# EAGLE design SparkFun_Qwiic_CO2_Sensor_XENSIV_PAS (EAGLE 9.6.2)
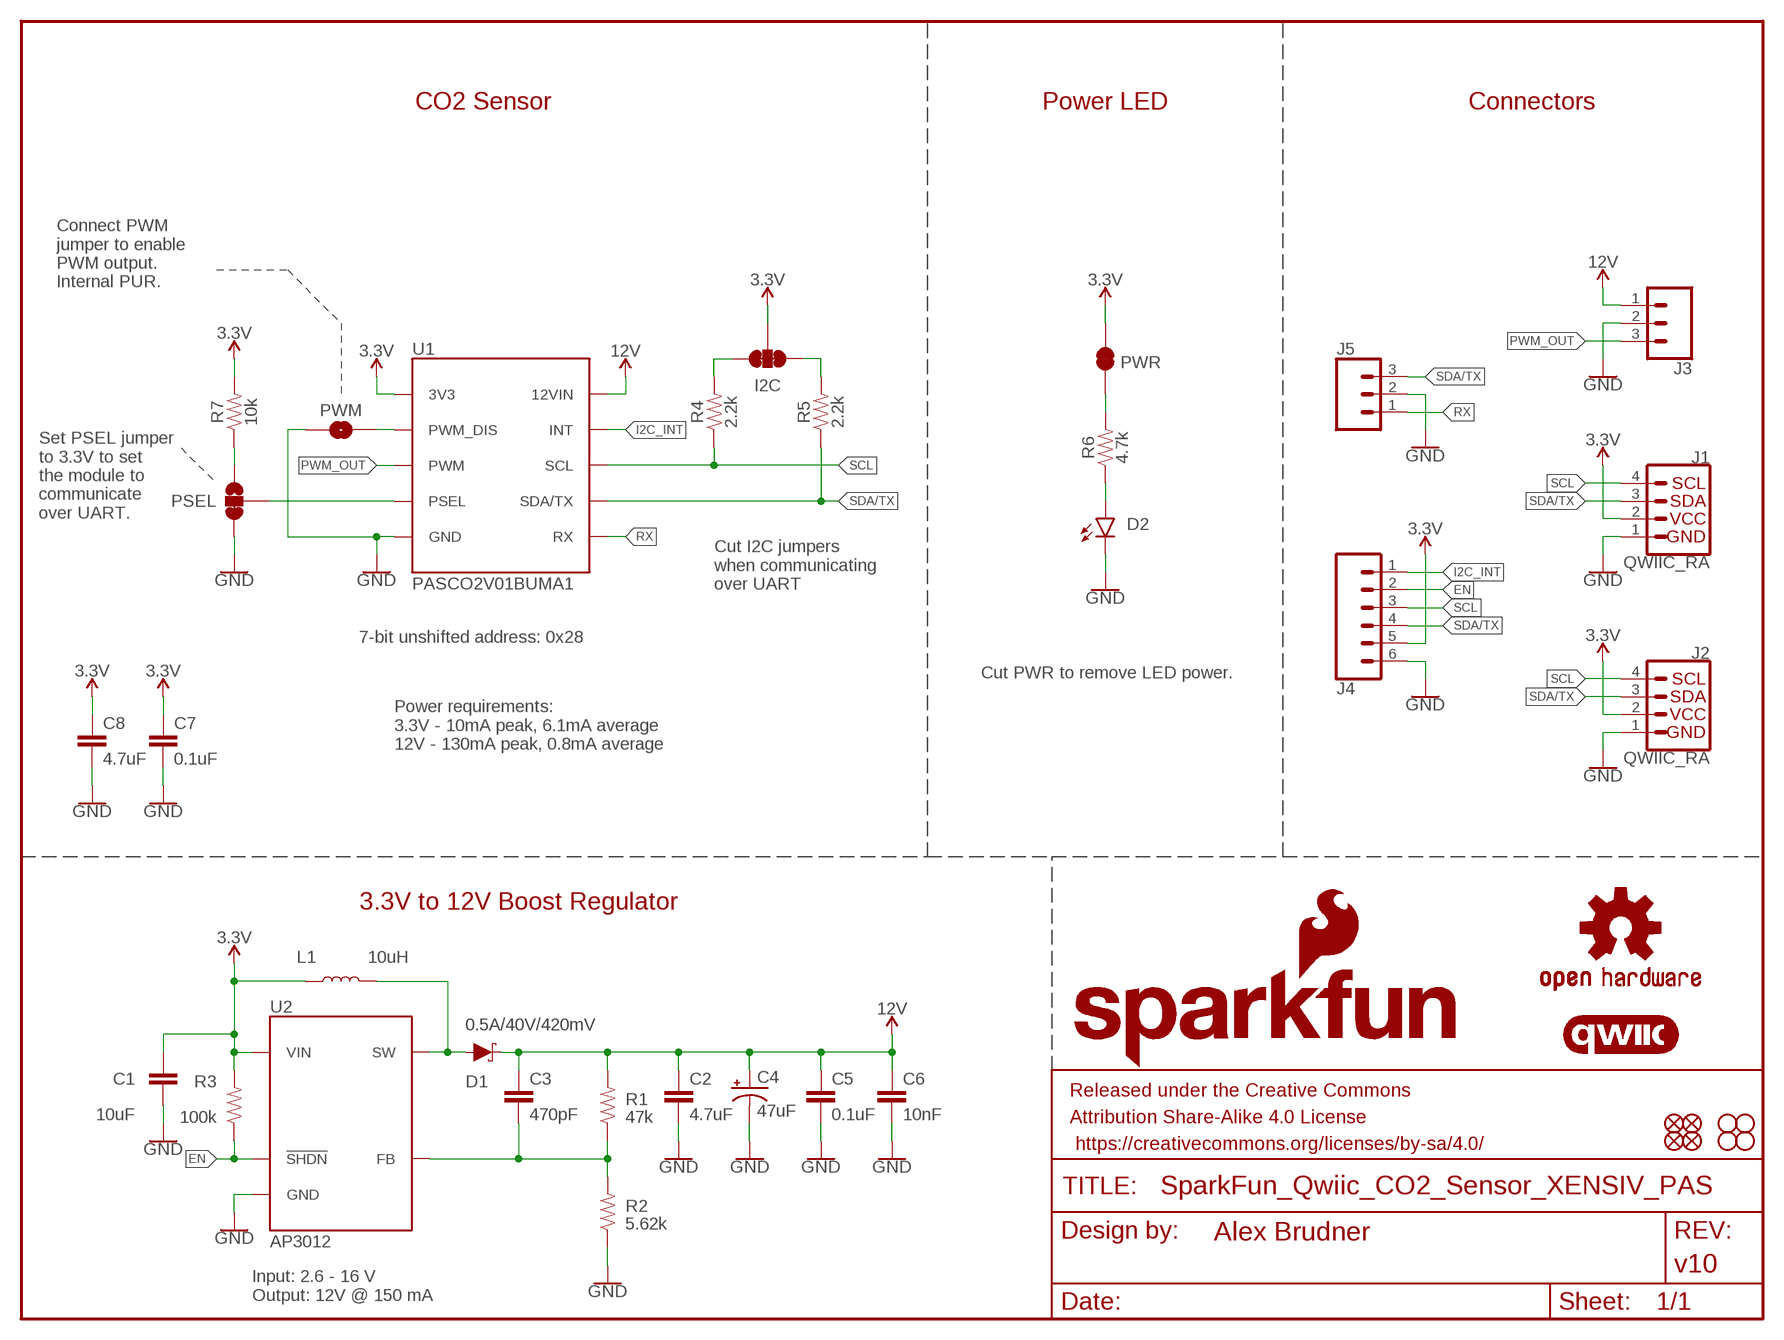
[diagram p0: schematic, sheet 1]

## Parts
C1  10uF  10UF-0805-25V-10%  [0805]
C2  4.7uF  4.7UF-0603-35V-(20%)  [0603]
C3  470pF  470PF-0603-50V-5%  [0603]
C4  47uF  47UF-POLAR-PANASONIC_D-35V-20%  [PANASONIC_D]
C5  0.1uF  0.1UF-0603-25V-5%  [0603]
C6  10nF  10NF-0603-50V-10%  [0603]
C7  0.1uF  0.1UF-0603-25V-5%  [0603]
C8  4.7uF  4.7UF-0603-35V-(20%)  [0603]
D1  0.5A/40V/420mV  DIODE-SCHOTTKY-PMEG4005EJ  [SOD-323]
D2  LED-RED_0603-KB  [LED-0603]
FD1  FIDUCIALUFIDUCIAL  [FIDUCIAL-MICRO]
FD2  FIDUCIALUFIDUCIAL  [FIDUCIAL-MICRO]
FD3  FIDUCIALUFIDUCIAL  [FIDUCIAL-MICRO]
FD4  FIDUCIALUFIDUCIAL  [FIDUCIAL-MICRO]
FRAME1  FRAME-LETTER  [CREATIVE_COMMONS]
H1  STAND-OFF  [STAND-OFF]
H2  STAND-OFF  [STAND-OFF]
H3  STAND-OFF  [STAND-OFF]
H4  STAND-OFF  [STAND-OFF]
I2C  JUMPER-SMT_3_2-NC_TRACE_SILK  [SMT-JUMPER_3_2-NC_TRACE_SILK]
J1  QWIIC_RA  QWIIC_CONNECTORJS-1MM  [JST04_1MM_RA]
J2  QWIIC_RA  QWIIC_CONNECTORJS-1MM  [JST04_1MM_RA]
J3  CONN_031X03_NO_SILK  [1X03_NO_SILK]
J4  CONN_06NO_SILK_NO_POP  [1X06_NO_SILK]
J5  CONN_031X03_NO_SILK  [1X03_NO_SILK]
L1  10uH  10UH  [0805]
LOGO1  SFE_LOGO_NAME_FLAME.1_INCH  [SFE_LOGO_NAME_FLAME_.1]
LOGO2  QWIIC_LOGO_5MM  [QWIIC_5MM]
LOGO3  OSHW-LOGOMINI  [OSHW-LOGO-MINI]
PSEL  JUMPER-SMT_3_1-NC_TRACE_SILK  [SMT-JUMPER_3_1-NC_TRACE_SILK]
PWM  JUMPER-SMT_2_NO_SILK  [SMT-JUMPER_2_NO_SILK]
PWR  JUMPER-SMT_2_NC_TRACE_SILK  [SMT-JUMPER_2_NC_TRACE_SILK]
R1  47k  47KOHM-0603-1/10W-1%  [0603]
R2  5.62k  5.62KOHM-0603-1/10W-1%  [0603]
R3  100k  100KOHM-0603-1/10W-1%  [0603]
R4  2.2k  2.2KOHM-0603-1/10W-1%  [0603]
R5  2.2k  2.2KOHM-0603-1/10W-1%  [0603]
R6  4.7k  4.7KOHM-0603-1/10W-1%  [0603]
R7  10k  10KOHM-0603-1/10W-1%  [0603]
U1  PASCO2V01BUMA1  PASCO2V01  [LG-MLGA-14-1_Z8B00206105]
U2  AP3012  [SOT95P280X145-5M]

## Nets
3.3V: C1.1 C7.1 C8.1 I2C.2 J1.2 J2.2 J4.5 L1.1 PWR.2 R3.2 R7.2 U1.1(3V3) U2.5(VIN)
12V: C2.1 C3.1 C4.+ C5.1 C6.1 D1.C J3.1 R1.2 U1.10(12VIN)
EN: J4.2 R3.1 U2.4(!SHDN!)
GND: C1.2 C2.2 C4.- C5.2 C6.2 C7.2 C8.2 D2.C J1.1 J2.1 J3.2 J4.6 J5.2 PSEL.3 PWM.1 R2.1 U1.6(GND) U1.11(GND) U1.12(GND) U1.13(GND) U1.14(GND) U2.2(GND)
I2C_INT: J4.1 U1.7(INT)
N$1: I2C.1 R5.2
N$2: D1.A L1.2 U2.1(SW)
N$3: I2C.3 R4.2
N$4: C3.2 R1.1 R2.2 U2.3(FB)
N$5: PSEL.2 U1.8(PSEL)
N$6: D2.A R6.1
N$7: PWR.1 R6.2
N$8: PSEL.1 R7.1
N$9: PWM.2 U1.5(PWM_DIS)
PWM_OUT: J3.3 U1.9(PWM)
RX: J5.1 U1.2(RX)
SCL: J1.4 J2.4 J4.3 R4.1 U1.3(SCL)
SDA/TX: J1.3 J2.3 J4.4 J5.3 R5.1 U1.4(SDA/TX)

## Notes on the sheet
- CO2 Sensor | Power LED | Connectors
- Connect PWM 
  jumper to enable 
  PWM output.
  Internal PUR.
- Set PSEL jumper 
  to 3.3V to set 
  the module to 
  communicate 
  over UART.
- Cut I2C jumpers 
  when communicating
  over UART
- 7-bit unshifted address: 0x28
- Cut PWR to remove LED power.
- Power requirements:
  3.3V - 10mA peak, 6.1mA average
  12V - 130mA peak, 0.8mA average
- 3.3V to 12V Boost Regulator
- Input: 2.6 - 16 V
  Output: 12V @ 150 mA

## Library data of the parts
C1 = SparkFun-Capacitors:10UF: 10.0µF ceramic capacitors A capacitor is a passive two-terminal electrical component used to store electrical energy temporarily in an electric field.; PROD_ID: CAP-14259
C2 C8 = SparkFun-Capacitors:4.7UF: 4.7µF ceramic capacitors A capacitor is a passive two-terminal electrical component used to store electrical energy temporarily in an electric field.; PROD_ID: CAP-14106
C3 = SparkFun-Capacitors:470PF: 470pF ceramic capacitors A capacitor is a passive two-terminal electrical component used to store electrical energy temporarily in an electric field.; PROD_ID: CAP-07884
C4 = SparkFun-Capacitors:47UF-POLAR: 47µF polarized capacitors A capacitor is a passive two-terminal electrical component used to store electrical energy temporarily in an electric field.; PROD_ID: CAP-08478
C5 C7 = SparkFun-Capacitors:0.1UF: 0.1µF ceramic capacitors A capacitor is a passive two-terminal electrical component used to store electrical energy temporarily in an electric field.; PROD_ID: CAP-08604
C6 = SparkFun-Capacitors:10NF: 0.01uF/10nF/10,000pF ceramic capacitors A capacitor is a passive two-terminal electrical component used to store electrical energy temporarily in an electric field. CAP-09321; PROD_ID: CAP-00867
D1 = SparkFun-DiscreteSemi:DIODE-SCHOTTKY: Schottky diode A Schottky diode is a semiconductor diode which has a low forward voltage drop and a very fast switching action.; PROD_ID: DIO-10955
D2 = SparkFun-LED:LED-RED: Red SMD LED Used in manufacturing of most products at SparkFun Packages: 0603 - KB - KingBright (DIO-17976) SMD 0603 package [Datasheet] <https://www.kingbrightusa.com/images/catalog/SPEC/APT1608SURCK.pdf> 0603 - (DIO-00819, has gone EOL) SMD 0603 package 0603 SMART - SMD 0603 SMART package ( more efficient and expensive)[Product Link] <http://www.osram-os.com/Graphics/XPic2/00077099_0.pdf> 1206 - SMD1206 package [Product Link] <https://www.sparkfun.com/datasheets/DevTools/LilyPad/Q150OVS4.pdff> SparkFun Products: Pro Mini 328 -5V <https://www.sparkfun.com/products/821> RedBoard <https://www.sparkfun.com/products/12757> IOIO-OTG <https://www.sparkfun.com/products/13613>; PROD_ID: DIO-17976
FD1-FD4 = SparkFun-Aesthetics:FIDUCIAL: Fiducial Alignment Points Point-of-reference for pick-and-place machines and other optical instruments.
FRAME1 = SparkFun-Aesthetics:FRAME-LETTER: Schematic Frame - Letter Standard 8.5x11 US Letter frame; DESIGNER: Alex Brudner; REV: v10
H1-H4 = SparkFun-Hardware:STAND-OFF: Stand Off Drill holes for mechanically mounting via screws, standoffs, etc. Note: Use the keepout ring to avoid running the screw head into surrounding components. Variant Overviews STAND-OFF - Mechanical footprint for a #4 phillips button head screw. STAND-OFF-TIGHT - Mechanical footprint for a #4 phillips button head screw, Example SparkFun Products Screw - Phillips Head (1/4", 4-40, 10 pack) <https://www.sparkfun.com/products/10453> (PRT-10453) Screw - Phillips Head (1/2", 4-40, 10 pack) <https://www.sparkfun.com/products/10452> (PRT-10452) Screw - Phillips Head (3/4", 4-40, 10 pack) <https://www.sparkfun.com/products/10451> (PRT-10451) Screw - Phillips Head (1", 4-40, 10 pack) <https://www.sparkfun.com/products/10450> (PRT-10450)
I2C = SparkFun-Jumpers:JUMPER-SMT_3_2-NC_TRACE: Normally closed trace jumper (2 of 2 connections) This jumper has a trace between all three pads so they are normally closed (NC). Use a razor knife to open the connection(s). For best results follow the IPC guidelines for cutting traces: Cutout at least 0.063 mm (0.005 in). Remove all loose material to clean up the cut area. Seal the cut with an approved epoxy. Reapply solder to reclose the connection(s).
J1 J2 = SparkFun-Connectors:QWIIC_CONNECTOR: SparkFun I2C Standard Qwiic Connector An SMD 1mm pitch JST connector makes it easy and quick (get it? Qwiic?) to connect I2C devices to each other. The Qwiic system <http://www.sparkfun.com/qwiic> enables fast and solderless connection between popular platforms and various sensors and actuators. We carry 200mm <https://www.sparkfun.com/products/14204>, 100mm <https://www.sparkfun.com/products/14205>, 50mm <https://www.sparkfun.com/products/14206>, and breadboard friendly <https://www.sparkfun.com/products/14207> Qwiic cables. We also offer 10 pcs strips <https://www.sparkfun.com/products/14323> the SMD connectors.; PROD_ID: CONN-13694; VALUE: QWIIC_RIGHT_ANGLE
J3 J5 = SparkFun-Connectors:CONN_03: Multi connection point. Often used as Generic Header-pin footprint for 0.1 inch spaced/style header connections On any of the 0.1 inch spaced packages, you can populate with these: Break Away Headers - Straight <https://www.sparkfun.com/products/116> (PRT-00116) Break Away Male Headers - Right Angle <https://www.sparkfun.com/products/553> (PRT-00553) Female Headers <https://www.sparkfun.com/products/115> (PRT-00115) Break Away Headers - Machine Pin <https://www.sparkfun.com/products/117> (PRT-00117) Break Away Female Headers - Swiss Machine Pin <https://www.sparkfun.com/products/743> (PRT-00743) Stackable Header - 3 Pin (Female, 0.1") <https://www.sparkfun.com/products/13875> (PRT-13875) For SCREWTERMINALS and SPRING TERMINALS visit here: Screw Terimnals on SparkFun.com <https://www.sparkfun.com/search/results?term=Screw+Terminals> (5mm/3.5mm/2.54mm spacing) This device is also useful as a general connection point to wire up your design to another part of your project. Our various solder wires solder well into these plated through hole pads. Hook-Up Wire - Assortment (Stranded, 22 AWG) <https://www.sparkfun.com/products/11375> (PRT-11375) Hook-Up Wire - Assortment (Solid Core, 22 AWG) <https://www.sparkfun.com/products/11367> (PRT-11367) View the entire wire category on our website here <https://www.sparkfun.com/categories/141> Special notes: Molex polarized connector foot print use with SKU : PRT-08232 with associated crimp pins and housings.
J4 = SparkFun-Connectors:CONN_06: Multi connection point. Often used as Generic Header-pin footprint for 0.1 inch spaced/style header connections On any of the 0.1 inch spaced packages, you can populate with these: Break Away Headers - Straight <https://www.sparkfun.com/products/116> (PRT-00116) Break Away Male Headers - Right Angle <https://www.sparkfun.com/products/553> (PRT-00553) Female Headers <https://www.sparkfun.com/products/115> (PRT-00115) Break Away Headers - Machine Pin <https://www.sparkfun.com/products/117> (PRT-00117) Break Away Female Headers - Swiss Machine Pin <https://www.sparkfun.com/products/743> (PRT-00743) Arduino Stackable Header - 6 Pin <https://www.sparkfun.com/products/9280> (PRT-09280) Screw Terminals 2.54mm Pitch (6-Pin) <https://www.sparkfun.com/products/16499> (PRT-16499) For SCREWTERMINALS and SPRING TERMINALS visit here: Screw Terimnals on SparkFun.com <https://www.sparkfun.com/search/results?term=Screw+Terminals> (5mm/3.5mm/2.54mm spacing) This device is also useful as a general connection point to wire up your design to another part of your project. Our various solder wires solder well into these plated through hole pads. Hook-Up Wire - Assortment (Stranded, 22 AWG) <https://www.sparkfun.com/products/11375> (PRT-11375) Hook-Up Wire - Assortment (Solid Core, 22 AWG) <https://www.sparkfun.com/products/11367> (PRT-11367) View the entire wire category on our website here <https://www.sparkfun.com/categories/141>
L1 = xensiv_pas:10UH; PN: MLZ2012M100WT000; PROD_ID: NDUC-19198
LOGO1 = SparkFun-Aesthetics:SFE_LOGO_NAME_FLAME: SparkFun Font Logo w/ Flame This is the SparkFun full logo. The logo on the schematic will always be the same size; the package variant is the height of the flame part of the logo. Default layer for the logo on the board is tSilk.
LOGO2 = SparkFun-Aesthetics:QWIIC_LOGO: Qwiic Logos for placement on schematic and PCB. The 5.5mm silk logo is best for placing next to Qwiic connector.
LOGO3 = SparkFun-Aesthetics:OSHW-LOGO: Open-Source Hardware (OSHW) Logo This logo indicates the piece of hardware it is found on incorporates a OSHW license and/or adheres to the definition of open source hardware found here: http://freedomdefined.org/OSHW
PSEL = SparkFun-Jumpers:JUMPER-SMT_3_1-NC_TRACE: Normally closed trace jumper (1 of 2 connections) This jumper has a trace between two pads so it's normally closed (NC). The other connection is normally open (NO). Use a razor knife to open the connection. For best results follow the IPC guidelines for cutting traces: Cutout at least 0.063 mm (0.005 in). Remove all loose material to clean up the cut area. Seal the cut with an approved epoxy. Reapply solder to reclose the connection, or to close the NO connection.
PWM = SparkFun-Jumpers:JUMPER-SMT_2_NO: Normally open jumper This jumper has two pads in close proximity to each other. Apply solder to close the connection. Round pads are easier to solder for beginners, but are a lot larger. SparkFun Product that uses the round pads: SparkFun EL Sequencer <https://www.sparkfun.com/products/12781>
PWR = SparkFun-Jumpers:JUMPER-SMT_2_NC_TRACE: Normally closed trace jumper This jumper has a trace between two pads so it's normally closed (NC). Use a razor knife to open the connection. For best results follow the IPC guidelines for cutting traces: Cutout at least 0.063 mm (0.005 in). Remove all loose material to clean up the cut area. Seal the cut with an approved epoxy. Reapply solder to reclose the connection.
R1 = SparkFun-Resistors:47KOHM: 47kΩ resistor A resistor is a passive two-terminal electrical component that implements electrical resistance as a circuit element. Resistors act to reduce current flow, and, at the same time, act to lower voltage levels within circuits. - Wikipedia; PROD_ID: RES-07871
R2 = SparkFun-Resistors:5.62KOHM: 5.62kΩ resistor A resistor is a passive two-terminal electrical component that implements electrical resistance as a circuit element. Resistors act to reduce current flow, and, at the same time, act to lower voltage levels within circuits. - Wikipedia; PROD_ID: RES-09823
R3 = SparkFun-Resistors:100KOHM: 100kΩ resistor A resistor is a passive two-terminal electrical component that implements electrical resistance as a circuit element. Resistors act to reduce current flow, and, at the same time, act to lower voltage levels within circuits. - Wikipedia; PROD_ID: RES-07828
R4 R5 = SparkFun-Resistors:2.2KOHM: 2.2kΩ resistor A resistor is a passive two-terminal electrical component that implements electrical resistance as a circuit element. Resistors act to reduce current flow, and, at the same time, act to lower voltage levels within circuits. - Wikipedia; PROD_ID: RES-08272
R6 = SparkFun-Resistors:4.7KOHM: 4.7kΩ resistor A resistor is a passive two-terminal electrical component that implements electrical resistance as a circuit element. Resistors act to reduce current flow, and, at the same time, act to lower voltage levels within circuits. - Wikipedia; PROD_ID: RES-07857
R7 = SparkFun-Resistors:10KOHM: 10kΩ resistor A resistor is a passive two-terminal electrical component that implements electrical resistance as a circuit element. Resistors act to reduce current flow, and, at the same time, act to lower voltage levels within circuits. - Wikipedia; PROD_ID: RES-00824
U1 = xensiv_pas:PASCO2V01; PROD_ID: IC-19132
U2 = xensiv_pas:AP3012; PN: AP3012; PROD_ID: VREG-13911

## Board
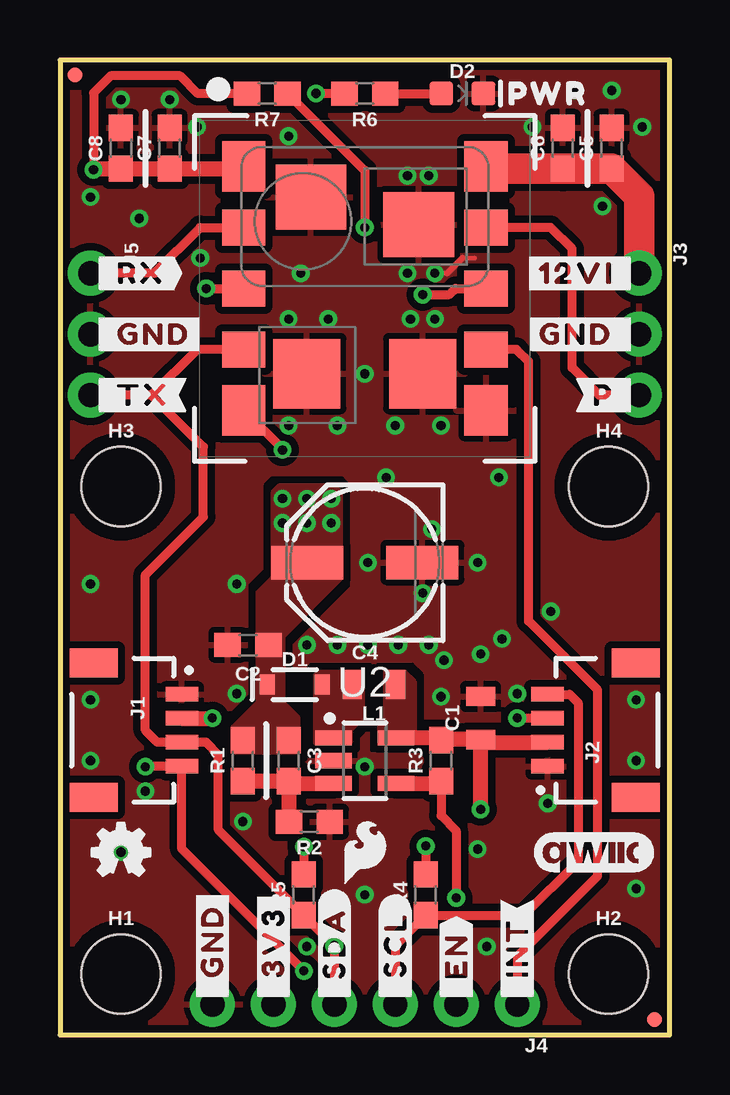
[diagram p1: board, top side]
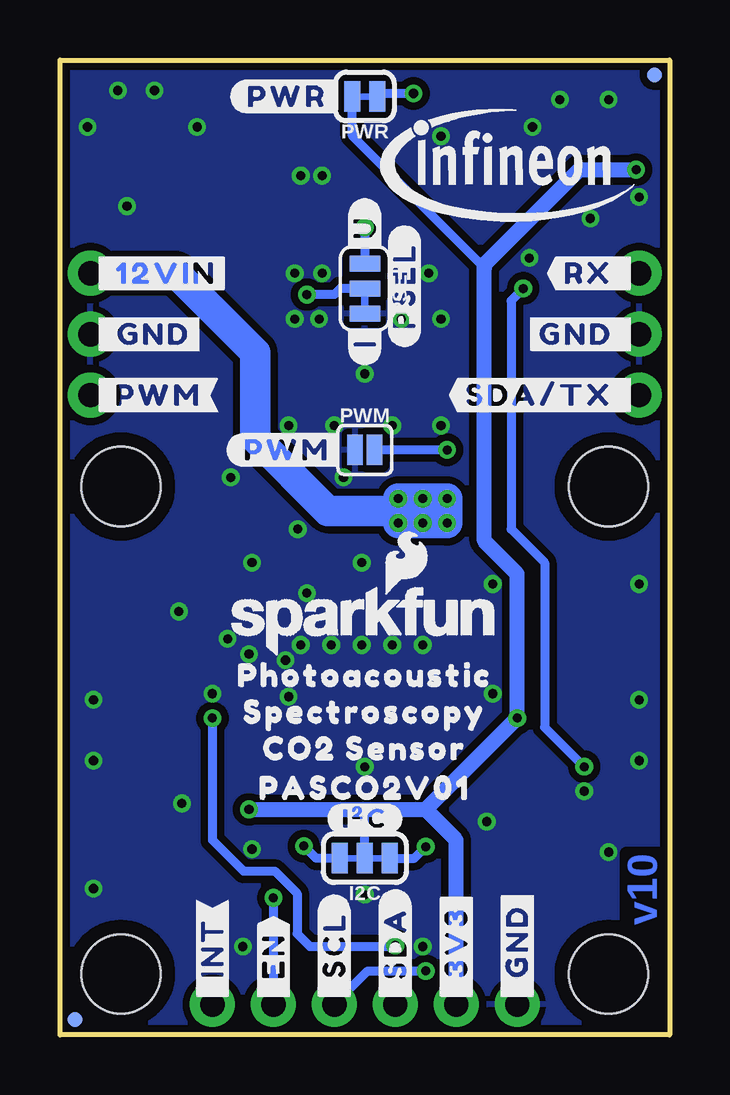
[diagram p2: board, bottom side, seen from below]

Size 25.4 x 40.64 mm. Coordinates in mm from the lower left corner, seen from the top.
Outline: 0,0 25.4,0 25.4,40.64 0,40.64 0,0
Copper layers (1*16): Top 0.035mm / dielectric 1.5mm / Bottom 0.035mm
Design rules "SparkFun-2-Layer-General-JLCPCB": minimum track width 7mil, minimum drill 0.3mm, track to track 7mil, track to pad 7mil, pad to pad 7mil, via to via 7mil, smd to smd 7mil, copper to edge 7mil, drill to drill 7mil, minimum pad ring 7mil, minimum via ring 7mil, stop-mask expansion 3mil, vias tented up to drill 25mil, thermal gap 10mil
tRestrict: area 9.8,14.9 to 10.2,15

### Footprints (pad centres in the part's own frame; a part is rotated, then mirrored left to right if it is on the bottom)
0805 = smd 0.8 x 1.2: 1 -0.9,0; 2 0.9,0
0603 = smd 1.1 x 1: 1 -0.85,0; 2 0.85,0
PANASONIC_D = smd 3 x 1.4: + 2.4,0; - -2.4,0
SOD-323 = smd 0.63 x 0.83: A 1.15,0; C -1.15,0
LED-0603 = smd 1 x 1: A -0.877,0; C 0.877,0
FIDUCIAL-MICRO = smd 0.635 x 0.635: 1 0,0
STAND-OFF = hole 3.302: 0,0
SMT-JUMPER_3_2-NC_TRACE_SILK = smd 0.66 x 1.27: 1 -1.041,0; 2 0,0; 3 1.041,0
JST04_1MM_RA = smd 0.6 x 1.35: 1 -1.5,0; 2 -0.5,0; 3 0.5,0; 4 1.5,0 | smd 1.2 x 2: NC1 2.8,-3.675; NC2 -2.8,-3.675
1X03_NO_SILK = drill 1.016 pad 1.88: 1 0,0; 2 2.54,0; 3 5.08,0
1X06_NO_SILK = drill 1.016 pad 1.88: 1 0,0; 2 2.54,0; 3 5.08,0; 4 7.62,0; 5 10.16,0; 6 12.7,0
SMT-JUMPER_3_1-NC_TRACE_SILK = smd 0.66 x 1.27: 1 -1.041,0; 2 0,0; 3 1.041,0
SMT-JUMPER_2_NO_SILK = smd 0.635 x 1.27: 1 -0.406,0; 2 0.406,0
SMT-JUMPER_2_NC_TRACE_SILK = smd 0.66 x 1.27: 1 -0.521,0; 2 0.521,0
LG-MLGA-14-1_Z8B00206105 = smd 2.1 x 1.8: 1 -5.08,-5.05; 5 5.08,-5.05; 6 5.08,5.05; 10 -5.08,5.05 | smd 1.5 x 1.8: 2 -2.54,-5.05; 3 0,-5.05; 4 2.54,-5.05; 7 2.54,5.05; 8 0,5.05; 9 -2.54,5.05 | smd 2.7 x 2.95: 11 -2.655,2.245; 12 -3.805,-2.245 | smd 2.9 x 2.8: 13 3.55,-2.415; 14 3.55,2.415
SOT95P280X145-5M = smd 1.509 x 0.629: 1 -1.303,0.95; 2 -1.303,0; 3 -1.303,-0.95; 4 1.303,-0.95; 5 1.303,0.95

### Placement (x,y rotation side)
C1  17.53,13.21 90 top
C2  7.83,16.26 180 top
C3  9.53,11.43 270 top
C4  12.7,19.68 180 top
C5  22.99,36.96 90 top
C6  20.95,36.96 90 top
C7  4.57,36.96 90 top
C8  2.54,36.96 90 top
D1  9.78,14.61 0 top
D2  16.76,39.24 0 top
FD1  24.77,0.64 0 bottom
FD2  0.64,40.01 0 bottom
FD3  0.64,40.01 0 top
FD4  24.77,0.64 0 top
FRAME1  51.94,-9.4 0 top  (outside the outline)
H1  2.54,2.54 0 top
H2  22.86,2.54 0 top
H3  2.54,22.86 0 top
H4  22.86,22.86 0 top
I2C  12.7,7.37 180 bottom
J1  5.08,12.7 270 top
J2  20.32,12.7 90 top
J3  24.13,31.75 270 top
J4  19.05,1.27 180 top
J5  1.27,31.75 270 top
L1  13.08,14.61 180 top
LOGO1  12.7,17.27 0 bottom
LOGO2  22.23,7.62 0 top
LOGO3  2.54,7.62 0 top
PSEL  12.7,31.11 270 bottom
PWM  12.7,24.38 0 bottom
PWR  12.7,39.12 180 bottom
R1  7.62,11.43 90 top
R2  10.39,8.89 180 top
R3  15.88,11.43 90 top
R4  15.24,5.84 90 top
R5  10.16,5.84 90 top
R6  12.7,39.24 180 top
R7  8.64,39.24 180 top
U1  12.7,31.11 270 top
U2  12.7,11.43 0 top
U$1  [SFE_LOGO_FLAME_.1]  12.7,7.62 0 top
U$2  [#_12VIN#0]  24.13,31.75 0 bottom
U$3  [#_EN#0]  16.51,1.27 90 top
U$4  [#GND_#0]  24.13,29.21 0 top
U$5  [#GND_#0]  1.27,29.21 0 bottom
U$6  [#_TX#0]  1.27,26.67 0 top
U$7  [#_RX#0]  1.27,31.75 0 top
U$8  [#_GND#0]  1.27,29.21 0 top
U$9  [#_GND#0]  24.13,29.21 0 bottom
U$10  [#_EN#0]  16.51,1.27 90 bottom
U$11  [#_3V3#0]  8.89,1.27 90 bottom
U$12  [#RX_#0]  1.27,31.75 0 bottom
U$13  [#SDA#TX_#0]  1.27,26.67 0 bottom
U$14  [#_GND#0]  6.35,1.27 90 top
U$15  [#_SCL#0]  13.97,1.27 90 top
U$16  [#PWM#0]  13.46,24.38 0 bottom
U$17  [#P_#0]  24.13,26.67 0 top
U$18  [#_GND#0]  6.35,1.27 90 bottom
U$19  [#_3V3#0]  8.89,1.27 90 top
U$20  [#_SDA#0]  11.43,1.27 90 top
U$21  [#_INT#0]  19.05,1.27 90 top
U$22  [#_INT#0]  19.05,1.27 90 bottom
U$23  [INFINEON_LOGO]  7.58,37.36 0 bottom
U$24  [#PSEL#0]  11.05,28.7 90 bottom
U$25  [CO2_SENSOR0]  12.7,11.94 0 bottom
U$26  [SFE_LOGO_FLAME_STOP_.1]  22.86,36.83 0 bottom
U$27  [#I�C#0]  12.7,9.02 0 bottom
U$28  [#PWR#0]  13.59,39.12 0 bottom
U$29  [PWR0]  20.32,39.24 0 top
U$30  [ORDERING_INSTRUCTIONS]  31.24,50.8 0 top  (outside the outline)
U$31  [#I#0]  12.7,28.83 90 bottom
U$32  [#U#0]  12.7,33.66 90 bottom
U$33  [#12VI_#0]  24.13,31.75 0 top
U$34  [#_PWM#0]  24.13,26.67 0 bottom
U$35  [#_SDA#0]  11.43,1.27 90 bottom
U$36  [#_SCL#0]  13.97,1.27 90 bottom
U$37  [PHOTOACOUSTIC0]  12.7,14.99 0 bottom
U$38  [SPECTROSCOPY0]  12.7,13.46 0 bottom
U$39  [PASCO2V010]  12.7,10.29 0 bottom

### Tracks (layer width: path | path; a pad name or v marks a point on that pad's centre or on a via)
3.3V  (via drill 0.38)
  Top 0.381: R7.2 5.74,39.24 5,39.98 2.11,39.98 1.4,39.27 v1.4,36.07
  Top 0.635: 7.56,36.11 C7.1 C8.1 1.44,36.11 v1.4,36.07 | C1.1 17.63,12.2 J2.2 | v17.53,9.4 C1.1 | J1.2 v6.34,13.2 v6.35,13.21 | C1.1 15.9,12.31 R3.2 15.78,12.38 U2.5
  Top 0.762: 7.56,36.11 U1.1
  Bottom 0.381: PWR.2 13.22,37.48 7.72,31.98 | I2C.2 12.7,9.4
  Bottom 0.635: 10.16,9.4 v6.35,13.21 6.35,19.22 7.72,20.59 7.72,31.98 7.72,32.11 3.76,36.07 v1.4,36.07 | v17.53,9.4 12.7,9.4 10.16,9.4 | J4.5 8.89,8.13 10.16,9.4
  pour Top (isolate 0.305, no thermals): 13.34,12.19 13.34,12.83 13.59,13.08 13.59,15.11 14.35,15.11 14.73,14.73 14.73,12.19
12V  (via drill 0.38)
  Top 1.27: U1.10 17.84,36.11 C6.1 C5.1 24.13,34.96 J3.1
  Bottom 1.27: v10.29,21.34 v9.27,21.34 v9.27,22.35 v10.29,22.35 v11.3,22.35 v11.3,21.34 v10.29,21.34 | v10.29,21.34 10.79,21.84 14.24,21.84 17.27,24.87 17.27,28.45 20.57,31.75 J3.1
  pour Top (isolate 0.305, no thermals): 9.91,11.81 9.91,13.21 9.27,13.84 9.27,16.64 11.68,19.05 11.68,22.61 11.43,22.86 9.14,22.86 8.89,22.61 8.89,19.05 8.26,18.41 8.26,13.84 7.24,12.83 7.24,11.81
EN  (via drill 0.38)
  Top 0.381: R3.1 15.88,9.14 16.51,8.51 v16.51,5.71
  Top 0.635: U2.4 15.78,10.48 R3.1
  Bottom 0.381: v16.51,5.71 J4.2
GND  (via drill 0.38)
  Top 0.178: v15.62,31.75 16.13,31.75 | 16.76,32.38 17.27,32.38
  Top 0.254: 16.13,31.75 16.76,32.38
  other vias: 15.88,25.4 13.97,25.4 11.56,25.4 9.53,25.4 9.53,29.84 11.18,29.84 14.61,29.84 15.62,29.84 14.48,31.75 10.03,31.75 9.53,37.47 14.48,35.81 15.37,35.81 7.37,18.8 12.7,11.18 15.88,14.1 24,11.43 24,13.97 2.54,7.62 1.27,11.43 1.27,13.97 1.27,18.8 12.83,19.68 17.4,19.68 12.7,27.56 3.3,34.04 1.27,34.92 5.71,37.85 2.54,38.99 4.57,38.99 21.46,39.37 22.99,39.37 24.26,37.85 19.68,37.85 22.61,34.54 18.29,23.24 10.29,16.26 13.59,23.24 15.49,21.08 15.11,18.41 17.53,15.88 11.56,16.26 12.83,16.26 14.1,16.26 15.37,16.26 16,15.62 7.37,14.22 20.45,17.65 18.41,16.51 24,6.1 5.84,32.38 20.32,9.65 17.4,7.75 17.78,3.68 7.62,8.89 10.29,3.68 3.56,10.16 19.05,14.22 12.7,5.84
  pour Bottom (isolate 0.305, rank 2): 0,40.64 0,0 25.4,0 25.4,40.64
  pour Top (isolate 0.305, rank 2): 0,0 25.4,0 25.4,40.64 0,40.64
I2C_INT
  Top 0.381: U1.7 19.02,28.57 19.53,28.07 19.53,17.25 22.4,14.38 22.4,6.63 19.05,3.27 J4.1
N$1  (via drill 0.38)
  Top 0.381: v10.16,7.84 R5.2
  Bottom 0.381: I2C.1 10.64,7.37 v10.16,7.84
N$2
  pour Top (isolate 0.305, no thermals): 12.57,15.11 12.57,13.21 12.06,12.7 12.06,12.19 10.67,12.19 10.67,14.99 10.79,15.11
N$3  (via drill 0.38)
  Top 0.381: v15.24,7.87 R4.2
  Bottom 0.381: I2C.3 14.73,7.37 v15.24,7.87
N$4
  Top 0.635: R1.1 C3.2 | C3.2 9.62,10.48 U2.3 | C3.2 9.53,8.9 R2.2
N$5  (via drill 0.38)
  Top 0.381: v15.11,30.86 16.23,30.86 16.48,31.11 U1.8
  Bottom 0.381: PSEL.2 13.72,31.11 13.97,30.86 v15.11,30.86
N$6
  Top 0.381: R6.1 D2.A
N$7  (via drill 0.38)
  Top 0.381: R6.2 v10.67,39.24
  Bottom 0.381: v10.67,39.24 12.05,39.24 PWR.1
N$8  (via drill 0.38)
  Top 0.381: R7.1 12.7,36.03 v12.7,33.66
  Bottom 0.381: v12.7,33.66 PSEL.1
N$9  (via drill 0.38)
  Top 0.381: U1.5 9.27,24.41 v9.27,24.38
  Bottom 0.381: v9.27,24.38 PWM.2
PWM_OUT
  Top 0.381: J3.3 22.48,26.67 21.34,27.81 21.34,32.77 20.45,33.66 U1.9
RX
  Top 0.381: U1.2 5.84,33.66 3.94,31.75 J5.1
SCL  (via drill 0.38)
  Top 0.381: v6.1,31.11 U1.3 | J2.4 21.23,14.2 21.59,13.84 21.59,7.24 19.3,4.95 15.28,4.95 R4.1 13.97,3.72 J4.3 | v3.56,11.18 3.58,11.2 J1.4 5.08,7.75 v10.16,2.67
  Bottom 0.381: v3.56,11.18 5.21,12.83 5.21,19.68 6.6,21.08 6.6,30.61 v6.1,31.11 | v10.16,2.67 12.57,2.67 J4.3
SDA/TX  (via drill 0.38)
  Top 0.381: J4.4 v11.43,3.72 R5.1 6.6,8.55 6.6,11.68 6.08,12.2 J1.3 4.06,12.2 3.56,12.7 3.56,19.18 5.97,21.59 5.97,24.51 3.81,26.67 | J2.3 v19.06,13.2 v19.05,13.21 | 3.81,26.67 J5.3 | 3.81,26.67 5.71,28.57 U1.4
  Bottom 0.381: v19.05,13.21 19.05,8.13 17.75,6.83 16.46,6.83 15.52,5.89 15.52,4.22 14.99,3.68 11.47,3.68 v11.43,3.72

### Text on the board
Bottom: v10
Measures: All Units in Inches
tDocu: Thickness: 0.063 in | Finish Lead-Free HASL | Material: TG155 | Solder Mask: Red | Layers: 2 | Alex Brudner